# EAGLE schematic hover_controller1 (EAGLE 8.2.1)
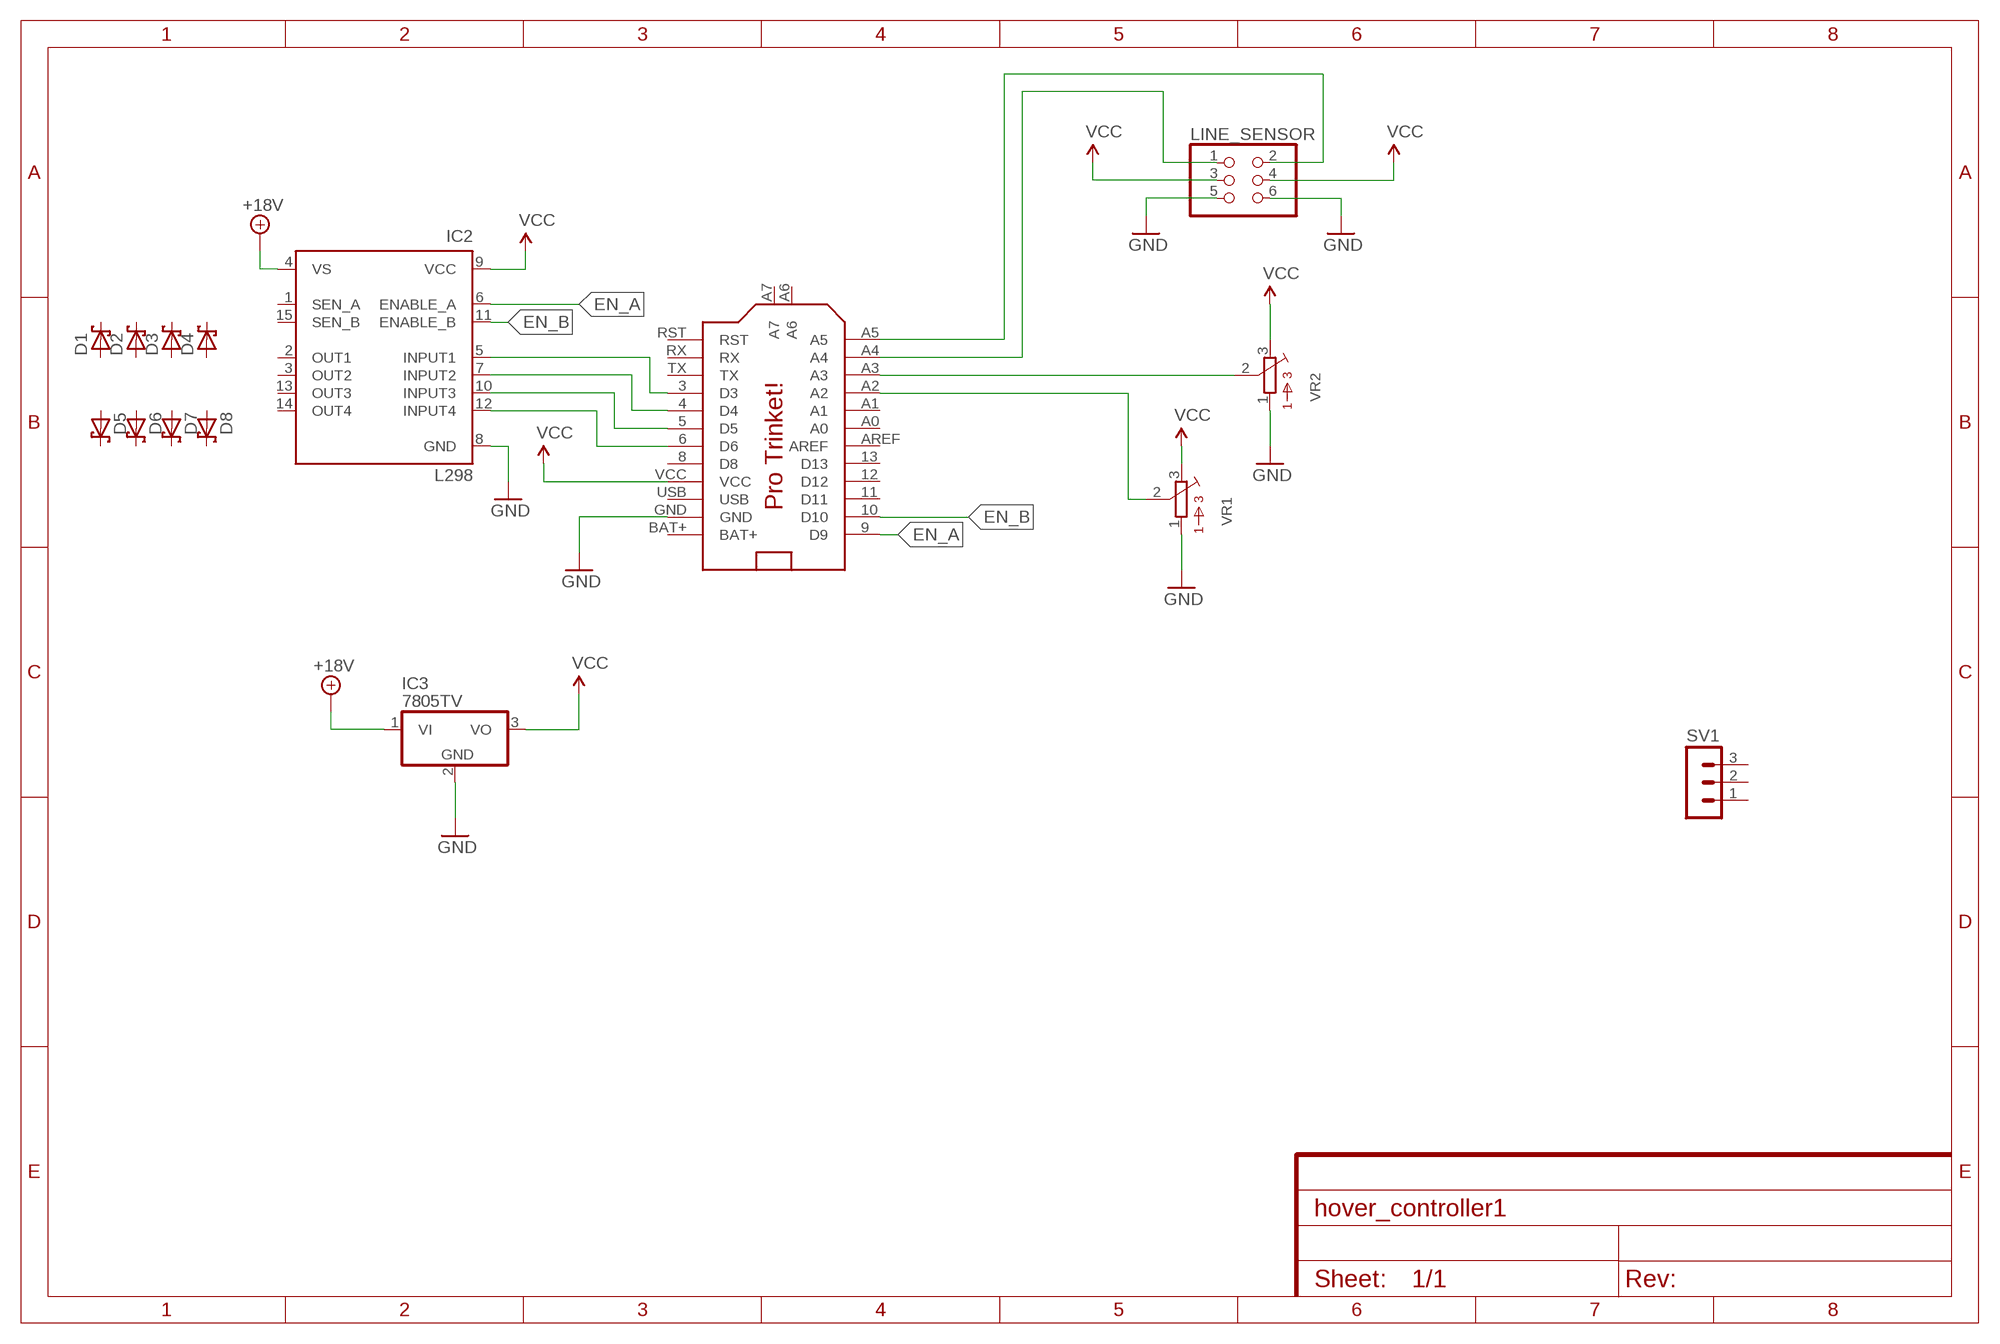
[diagram p0: schematic, sheet 1]

## Parts
D1  SCHOTTKY-DIODEDO35-7  [DO35-7]
D2  SCHOTTKY-DIODEDO35-7  [DO35-7]
D3  SCHOTTKY-DIODEDO35-7  [DO35-7]
D4  SCHOTTKY-DIODEDO35-7  [DO35-7]
D5  SCHOTTKY-DIODEDO35-7  [DO35-7]
D6  SCHOTTKY-DIODEDO35-7  [DO35-7]
D7  SCHOTTKY-DIODEDO35-7  [DO35-7]
D8  SCHOTTKY-DIODEDO35-7  [DO35-7]
IC2  L298  [MULTIWATT-15]
IC3  7805TV  [TO220V]
LINE_SENSOR  PINHD-2X3  [2X03]
SV1  MA03-1  [MA03-1]
U$1  PRO_TRINKET  [PROTRINKET]
VR1  BOURNS_3362P_TRIMMERP  [BOURNS_3362P_TRIMMER]
VR2  BOURNS_3362P_TRIMMERP  [BOURNS_3362P_TRIMMER]

## Nets
+18V: IC2.4(VS) IC3.1(VI)
EN_A: IC2.6(ENABLE_A) U$1.9(D9)
EN_B: IC2.11(ENABLE_B) U$1.10(D10)
GND: IC2.8(GND) IC3.2(GND) LINE_SENSOR.5 LINE_SENSOR.6 U$1.GND VR1.1 VR2.1
N$1: IC2.5(INPUT1) U$1.3(D3)
N$2: IC2.7(INPUT2) U$1.4(D4)
N$3: IC2.10(INPUT3) U$1.5(D5)
N$4: IC2.12(INPUT4) U$1.6(D6)
N$5: U$1.A3 VR2.2
N$6: U$1.A2 VR1.2
SCL: LINE_SENSOR.2 U$1.A5
SDA: LINE_SENSOR.1 U$1.A4
VCC: IC2.9(VCC) IC3.3(VO) LINE_SENSOR.3 LINE_SENSOR.4 U$1.VCC VR1.3 VR2.3
Unconnected: D1.A D1.C D2.A D2.C D3.A D3.C D4.A D4.C D5.A D5.C D6.A D6.C D7.A D7.C D8.A D8.C IC2.1(SEN_A) IC2.2(OUT1) IC2.3(OUT2) IC2.13(OUT3) IC2.14(OUT4) IC2.15(SEN_B) SV1.1 SV1.2 SV1.3 U$1.8(D8) U$1.11(D11) U$1.12(D12) U$1.13(D13) U$1.A0 U$1.A1 U$1.A6 U$1.A7 U$1.AREF U$1.RST U$1.RX U$1.TX

## Power pins joined to a net without a drawn wire
BAT+: U$1.BAT+
USB: U$1.USB

## Library data of the parts
D1-D8 = diode:SCHOTTKY-DIODE: Schottky Diode
IC2 = st-microelectronics:L298: DUAL FULL-BRIDGE DRIVER; MPN: L298N; OC_FARNELL: 1589425; OC_NEWARK: 32M1527
IC3 = linear:78*: Positive VOLTAGE REGULATOR Source: http://cache.national.com/ds/LM/LM78L05.pdf http://www.fairchildsemi.com/ds/LM/LM7805.pdf
LINE_SENSOR = pinhead:PINHD-2X3: PIN HEADER
SV1 = con-lstb:MA03-1: PIN HEADER; OC_FARNELL: unknown; OC_NEWARK: unknown
U$1 = adafruit:PRO_TRINKET
VR1 VR2 = MusicThingModular:BOURNS_3362P_TRIMMER: 3362 Series 1/4" Square Trimmer